# Altium schematic sheet TPS6120x.SchDoc
size A4
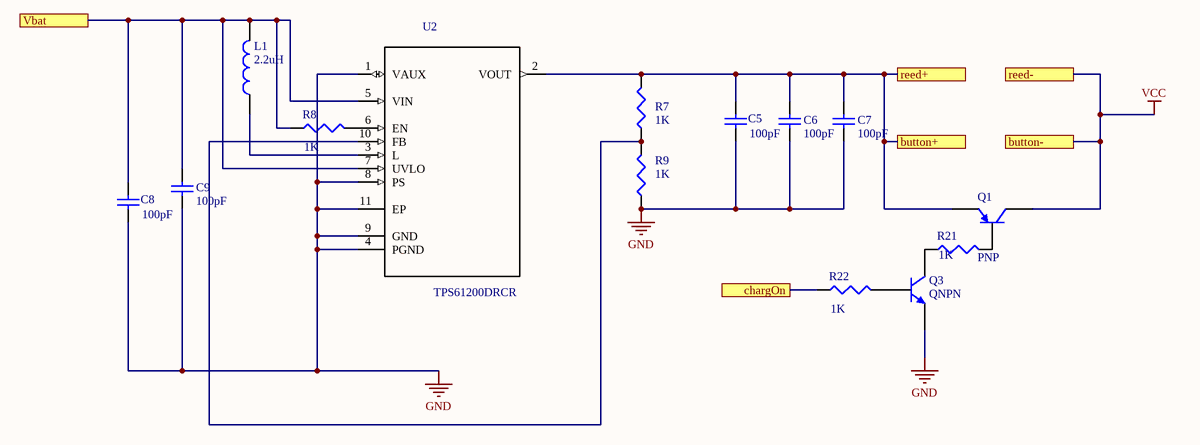
[diagram p0: TPS6120x.SchDoc]

## Parts
C5  value 100pF  [C1206]  (hidden comment: Cap Semi)
C6  value 100pF  [C1206]  (hidden comment: Cap Semi)
C7  value 100pF  [C1206]  (hidden comment: Cap Semi)
C8  value 100pF  [C1206]  (hidden comment: Cap Semi)
C9  value 100pF  [C1206]  (hidden comment: Cap Semi)
L1  value 2.2uH  [WE-TPC_2828]  (hidden comment: 744025002)
Q1  PNP  [SOT-23B_N]
Q3  QNPN  [SOT-23B_N]
R7  value 1K  [J1-0603]  (hidden comment: Res3)
R8  value 1K  [J1-0603]  (hidden comment: Res3)
R9  value 1K  [J1-0603]  (hidden comment: Res3)
R21  value 1K  [J1-0603]  (hidden comment: Res3)
R22  value 1K  [J1-0603]  (hidden comment: Res3)
U2  TPS61200DRCR  [SON50P300X300X100-11N]

## Ports
button+, button-, chargOn, reed+, reed-, Vbat

## Nets
GND: C5.2 C6.1 C7.1 C8.2 C9.1 Q3.3(E) R9.1 U2.1(VAUX) U2.4(PGND) U2.8(PS) U2.9(GND) U2.11(EP)
VCC: Q1.1(C) ; port button-, port reed-
button+: C5.1 C6.2 C7.2 Q1.3(E) R7.2 U2.2(VOUT) ; port button+, port reed+
chargOn: R22.1 ; port chargOn
Vbat: C8.1 C9.2 L1.2 R8.1 U2.5(VIN) U2.7(UVLO) ; port Vbat
NetL1_1: L1.1 U2.3(L)
NetQ1_2: Q1.2(B) R21.2
NetQ3_1: Q3.1(C) R21.1
NetQ3_2: Q3.2(B) R22.2
NetR7_1: R7.1 R9.2 U2.10(FB)
NetR8_2: R8.2 U2.6(EN)

## Library data of the parts
C5-C9 = Cap Semi: Capacitor (Semiconductor SIM Model); Published: 8-Jun-2000; LatestRevisionDate: 29-May-2009; LatestRevisionNote: IPC-7351 Footprint Added.; PackageReference: C1206; Publisher: Altium Limited; PackageDescription: Chip Capacitor
L1 = 744025002: WE-TPC SMD Shielded Tiny Power Inductor, size 2828, 1.8A, 57mΩ, 2.2uH; ComponentLink1Description: Manufacturer; ComponentLink1URL: http://www.we-online.de; ComponentLink2Description: Datasheet; ComponentLink2URL: http://katalog.we-online.de/pbs/datasheet/744025002.pdf; Part Number: 744025002; Published Date: July 2017; Publisher: Wurth Elektronik; Rated Current: 1.8A; Size: 2828; DC Resistance: 57mΩ
Q1 = PNP: PNP Bipolar Transistor; Published: 8-Jun-2000; LatestRevisionDate: 29-May-2009; LatestRevisionNote: IPC-7351 Footprint Added.; PackageVersion: Aug-1999; PackageReference: SOT-23B; Publisher: Altium Limited; PackageDescription: 3-Pin SOT-23 Package 0.95 mm Pitch, 2.4 mm Lead Span
Q3 = QNPN: NPN Bipolar Transistor; Published: 8-Jun-2000; LatestRevisionDate: 29-May-2009; LatestRevisionNote: IPC-7351 Footprint Added.; PackageVersion: Aug-1999; PackageReference: SOT-23B; Publisher: Altium Limited; PackageDescription: 3-Pin SOT-23 Package 0.95 mm Pitch, 2.4 mm Lead Span
R7-R9 R21 R22 = Res3: Resistor; Published: 8-Jun-2000; LatestRevisionDate: 29-May-2009; LatestRevisionNote: IPC-7351 Footprint Added.; PackageReference: J1-0603; Publisher: Altium Limited; PackageDescription: Chip Resistor
U2 = TPS61200DRCR: 0.3V Input Voltage Boost Converter with 1.3A Switches and 'Down Mode' in 3x3 QFN 10-VSON -40 to 85; MF: Texas Instruments; Package: VFDFN-10 Texas Instruments; MP: TPS61200DRCR; Price: 1.71 USD; Availability: Good; SnapEDA_Link: https://www.snapeda.com/symbols-footprints/TPS61200DRCR/Texas%20Instruments/view-part/?ref=snap; Value: *